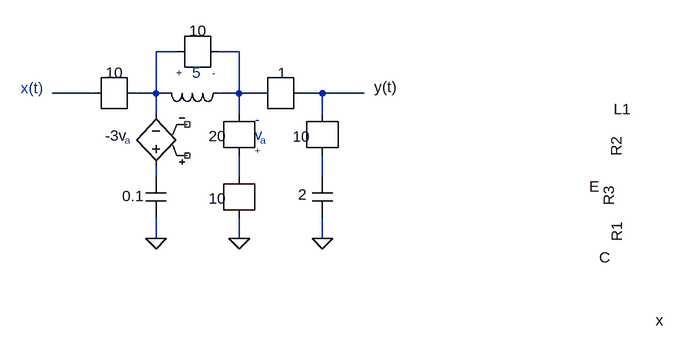
[diagram p0: schematic g2.asc]
g2.asc, the LTspice schematic file:
Version 4
SHEET 1 1080 680
WIRE 304 160 272 160
WIRE 400 160 368 160
WIRE 176 224 112 224
WIRE 272 224 272 160
WIRE 272 224 240 224
WIRE 288 224 272 224
WIRE 400 224 400 160
WIRE 400 224 368 224
WIRE 432 224 400 224
WIRE 528 224 496 224
WIRE 592 224 528 224
WIRE 272 256 272 224
WIRE 400 256 400 224
WIRE 528 256 528 224
WIRE 272 352 272 336
WIRE 400 352 400 320
WIRE 528 352 528 320
WIRE 272 448 272 416
WIRE 400 448 400 416
WIRE 528 448 528 416
FLAG 528 448 0
FLAG 400 448 0
FLAG 272 448 0
SYMBOL r 176 224 R0
WINDOW 0 805 198 VRight 2
WINDOW 3 467 -9 Right 2
SYMATTR InstName R1
SYMATTR Value y(t)
SYMBOL r 304 160 R0
WINDOW 0 676 131 VRight 2
WINDOW 3 645 172 VRight 2
SYMATTR InstName R2
SYMBOL r 432 224 R0
WINDOW 0 537 143 VRight 2
WINDOW 3 530 207 VRight 2
SYMATTR InstName R3
SYMBOL r 400 256 R90
WINDOW 0 -63 -73 VRight 2
WINDOW 3 34 20 VRight 2
SYMATTR InstName 1
SYMATTR Value 20
SYMBOL r 400 352 R90
WINDOW 0 -160 178 VRight 2
WINDOW 3 34 20 VRight 2
SYMATTR InstName 10
SYMATTR Value 10
SYMBOL r 528 256 R90
WINDOW 0 -128 178 VRight 2
WINDOW 3 35 19 VRight 2
SYMATTR InstName 10
SYMATTR Value 10
SYMBOL cap 256 352 R0
WINDOW 0 -36 30 Left 2
WINDOW 3 698 125 Left 2
SYMATTR InstName 0.1
SYMBOL cap 512 352 R0
WINDOW 0 529 222 Left 2
WINDOW 3 -21 28 Left 2
SYMATTR InstName x
SYMATTR Value 2
SYMBOL ind 384 208 R90
WINDOW 0 56 -606 VBottom 2
WINDOW 3 -26 51 VTop 1
SYMATTR InstName L1
SYMATTR Value +          -
SYMBOL e 272 352 R180
WINDOW 0 44 63 Left 2
WINDOW 3 -682 -16 Left 2
SYMATTR InstName -3v
TEXT 224 296 Left 1 ;a
TEXT 424 264 Left 2 ;-
TEXT 424 312 Left 1 ;+
TEXT 424 288 Left 2 ;v
TEXT 432 296 Left 1 ;a
TEXT 328 192 Left 2 ;5
TEXT 64 216 Left 2 ;x(t)

The netlist it stands for:
* g2.asc
R1 N001 N003 y(t)
R2 N002 N001
R3 N004 N002
R§1 N006 N002 20
R§10 0 N006 10
R§10 N007 N004 10
C§0.1 N005 0 C
C§x N007 0 2
L1 N002 N001 +          -
E§-3v N005 N001 NC_01 NC_02 E
* a
* -
* +
* v
* a
* 5
* x(t)
.backanno
.end